# Altium schematic sheet 01-MCU.SchDoc
size A3
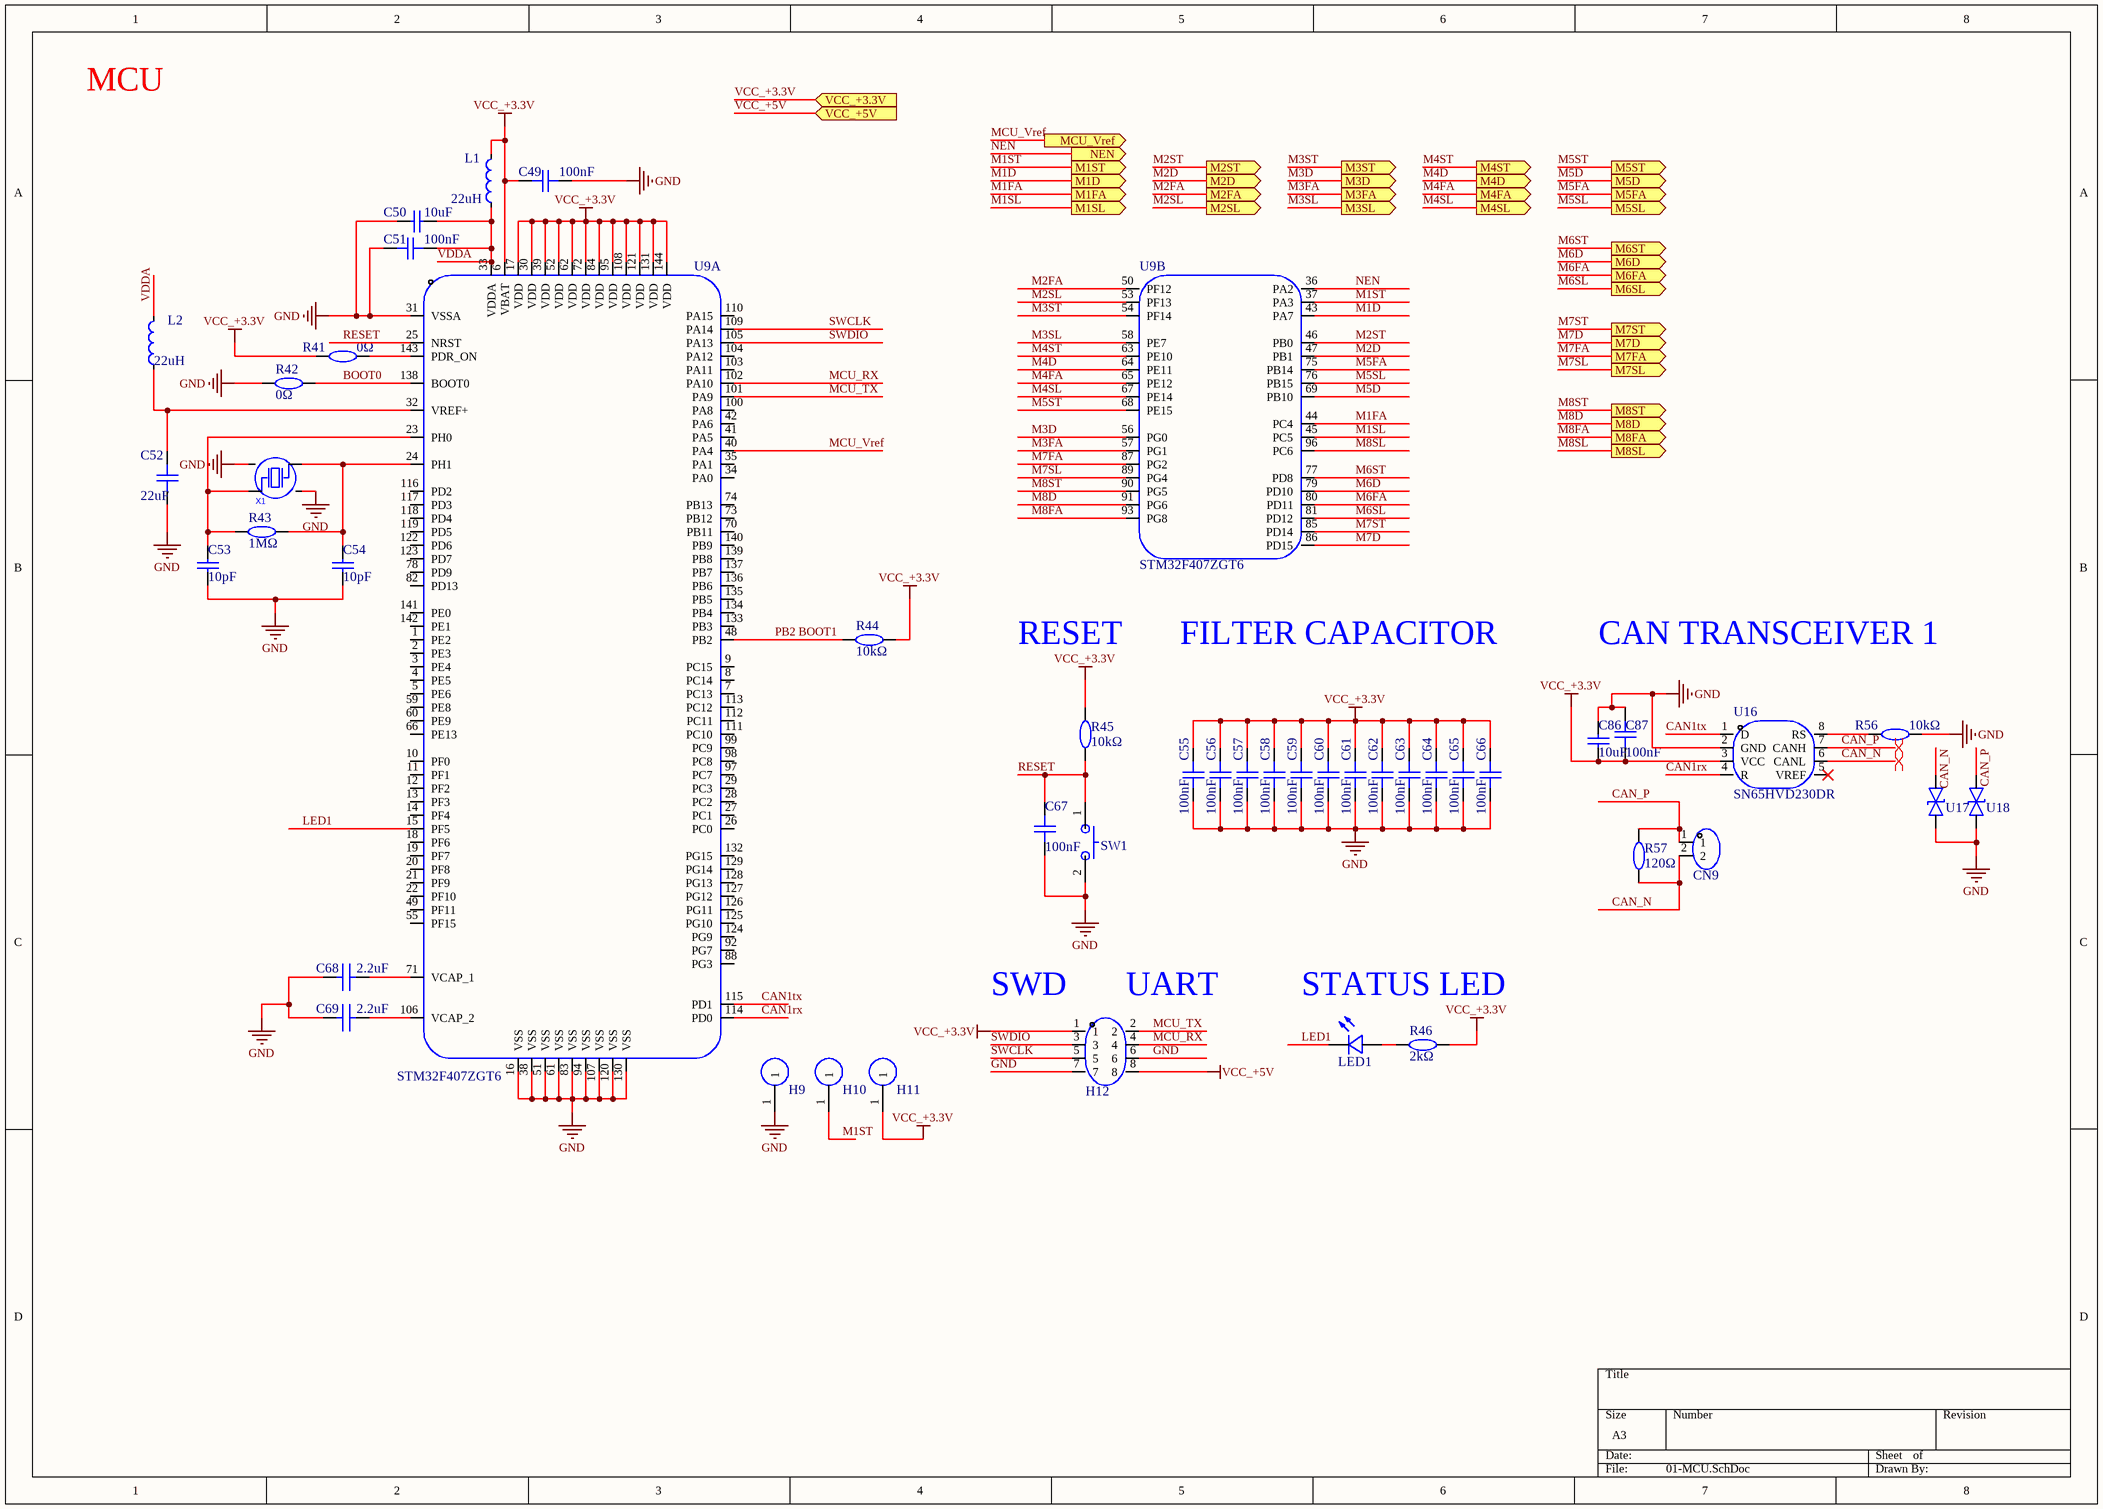
[diagram p0: 01-MCU.SchDoc]

## Parts
C49  100nF  [C0402_2.2uF]
C50  10uF  [C0402_2.2uF]
C51  100nF  [C0402_2.2uF]
C52  22uF  [C0603]
C53  10pF  [C0402_2.2uF]
C54  10pF  [C0402_2.2uF]
C55  100nF  [C0402_2.2uF]
C56  100nF  [C0402_2.2uF]
C57  100nF  [C0402_2.2uF]
C58  100nF  [C0402_2.2uF]
C59  100nF  [C0402_2.2uF]
C60  100nF  [C0402_2.2uF]
C61  100nF  [C0402_2.2uF]
C62  100nF  [C0402_2.2uF]
C63  100nF  [C0402_2.2uF]
C64  100nF  [C0402_2.2uF]
C65  100nF  [C0402_2.2uF]
C66  100nF  [C0402_2.2uF]
C67  100nF  [C0603]
C68  2.2uF  [C0402_2.2uF]
C69  2.2uF  [C0402_2.2uF]
C86  10uF  [C0402_2.2uF]
C87  100nF  [C0402_2.2uF]
CN9  ZX-XH2.54-2PZZ  [ZX-XH2.54-2PZZ]  (value not drawn)
H9  PZ254V-11-01P  [Testpoint]  (value not drawn)
H10  PZ254V-11-01P  [Testpoint]  (value not drawn)
H11  PZ254V-11-01P  [Testpoint]  (value not drawn)
H12  PZ254V-12-8P  [HC-1.25-8PLT]  (value not drawn)
L1  22uH  [L0603_22uH]
L2  22uH  [L0603_22uH]
LED1  MHT192UGCT  [LED]  (value not drawn)
R41  0Ω  [R0603]
R42  0Ω  [R0603]
R43  1MΩ  [R0603]
R44  10kΩ  [R0603_10KΩ]
R45  10kΩ  [R0603_10KΩ]
R46  2kΩ  [R0603]
R56  10kΩ  [R0603]
R57  120Ω  [R0603]
SW1  GT-TC029B-H020-L1N  [Switch]  (value not drawn)
U9  STM32F407ZGT6  [STM32F407ZGT6]  (parts A,B of 2)
U16  SN65HVD230DR  [SN65HVD230DR]
U17  PESD0603-240  [PESD0603-240]  (value not drawn)
U18  PESD0603-240  [PESD0603-240]  (value not drawn)
X1  8MHz  [Osc_8M]  (value not drawn)

## Ports
M1D (out), M1FA (out), M1SL (out), M1ST (out), M2D (out), M2FA (out), M2SL (out), M2ST (out), M3D (out), M3FA (out), M3SL (out), M3ST (out), M4D (out), M4FA (out), M4SL (out), M4ST (out), M5D (out), M5FA (out), M5SL (out), M5ST (out), M6D (out), M6FA (out), M6SL (out), M6ST (out), M7D (out), M7FA (out), M7SL (out), M7ST (out), M8D (out), M8FA (out), M8SL (out), M8ST (out), MCU_Vref (out), NEN (out), VCC_+3.3V (in), VCC_+5V (in)

## Nets
GND: C49.2 C50.1 C51.1 C52.1 C53.1 C54.1 C55.2 C56.2 C57.2 C58.2 C59.2 C60.2 C61.2 C62.2 C63.2 C64.2 C65.2 C66.2 C67.1 C68.1 C69.1 C86.2 C87.2 H9.1 H12.6 H12.7 R42.1 R56.2 SW1.2 U9.16(VSS) U9.31(VSSA) U9.38(VSS) U9.51(VSS) U9.61(VSS) U9.83(VSS) U9.94(VSS) U9.107(VSS) U9.120(VSS) U9.130(VSS) U16.2(GND) U17.1 U18.1 X1.2 X1.4
VCC_+3.3V: C49.1 C55.1 C56.1 C57.1 C58.1 C59.1 C60.1 C61.1 C62.1 C63.1 C64.1 C65.1 C66.1 C86.1 C87.1 H11.1 H12.1 L1.2 R41.1 R44.2 R45.2 R46.2 U9.6(VBAT) U9.17(VDD) U9.30(VDD) U9.39(VDD) U9.52(VDD) U9.62(VDD) U9.72(VDD) U9.84(VDD) U9.95(VDD) U9.108(VDD) U9.121(VDD) U9.131(VDD) U9.144(VDD) U16.3(VCC) ; port VCC_+3.3V
VCC_+5V: H12.8 ; port VCC_+5V
BOOT0: R42.2 U9.138(BOOT0)
CAN1rx: U9.114(PD0) U16.4(R)
CAN1tx: U9.115(PD1) U16.1(D)
CAN_N: CN9.2 R57.1 U16.6(CANL) U17.2
CAN_P: CN9.1 R57.2 U16.7(CANH) U18.2
LED1: LED1.1(-) U9.15(PF5)
M1D: U9.43(PA7) ; port M1D
M1FA: U9.44(PC4) ; port M1FA
M1SL: U9.45(PC5) ; port M1SL
M1ST: H10.1 U9.37(PA3) ; port M1ST
M2D: U9.47(PB1) ; port M2D
M2FA: U9.50(PF12) ; port M2FA
M2SL: U9.53(PF13) ; port M2SL
M2ST: U9.46(PB0) ; port M2ST
M3D: U9.56(PG0) ; port M3D
M3FA: U9.57(PG1) ; port M3FA
M3SL: U9.58(PE7) ; port M3SL
M3ST: U9.54(PF14) ; port M3ST
M4D: U9.64(PE11) ; port M4D
M4FA: U9.65(PE12) ; port M4FA
M4SL: U9.67(PE14) ; port M4SL
M4ST: U9.63(PE10) ; port M4ST
M5D: U9.69(PB10) ; port M5D
M5FA: U9.75(PB14) ; port M5FA
M5SL: U9.76(PB15) ; port M5SL
M5ST: U9.68(PE15) ; port M5ST
M6D: U9.79(PD10) ; port M6D
M6FA: U9.80(PD11) ; port M6FA
M6SL: U9.81(PD12) ; port M6SL
M6ST: U9.77(PD8) ; port M6ST
M7D: U9.86(PD15) ; port M7D
M7FA: U9.87(PG2) ; port M7FA
M7SL: U9.89(PG4) ; port M7SL
M7ST: U9.85(PD14) ; port M7ST
M8D: U9.91(PG6) ; port M8D
M8FA: U9.93(PG8) ; port M8FA
M8SL: U9.96(PC6) ; port M8SL
M8ST: U9.90(PG5) ; port M8ST
MCU_RX: H12.4 U9.102(PA10)
MCU_TX: H12.2 U9.101(PA9)
MCU_Vref: U9.40(PA4) ; port MCU_Vref
NEN: U9.36(PA2) ; port NEN
PB2 BOOT1: R44.1 U9.48(PB2)
RESET: C67.2 R45.1 SW1.1 U9.25(NRST)
SWCLK: H12.5 U9.109(PA14)
SWDIO: H12.3 U9.105(PA13)
VDDA: C50.2 C51.2 L1.1 L2.2 U9.33(VDDA)
NetC52_2: C52.2 L2.1 U9.32(VREF+)
NetC53_2: C53.2 R43.1 U9.23(PH0) X1.1
NetC54_2: C54.2 R43.2 U9.24(PH1) X1.3
NetC68_2: C68.2 U9.71(VCAP_1)
NetC69_2: C69.2 U9.106(VCAP_2)
NetLED1_2: LED1.2(+) R46.1
NetR41_2: R41.2 U9.143(PDR_ON)
NetR56_1: R56.1 U16.8(RS)

Not connected (* = marked no-connect by the designer): U9 1(PE2) 2(PE3) 3(PE4) 4(PE5) 5(PE6) 7(PC13) 8(PC14) 9(PC15) 10(PF0) 11(PF1) 12(PF2) 13(PF3) 14(PF4) 18(PF6) 19(PF7) 20(PF8) 21(PF9) 22(PF10) 26(PC0) 27(PC1) 28(PC2) 29(PC3) 34(PA0) 35(PA1) 41(PA5) 42(PA6) 49(PF11) 55(PF15) 59(PE8) 60(PE9) 66(PE13) 70(PB11) 73(PB12) 74(PB13) 78(PD9) 82(PD13) 88(PG3) 92(PG7) 97(PC7) 98(PC8) 99(PC9) 100(PA8) 103(PA11) 104(PA12) 110(PA15) 111(PC10) 112(PC11) 113(PC12) 116(PD2) 117(PD3) 118(PD4) 119(PD5) 122(PD6) 123(PD7) 124(PG9) 125(PG10) 126(PG11) 127(PG12) 128(PG13) 129(PG14) 132(PG15) 133(PB3) 134(PB4) 135(PB5) 136(PB6) 137(PB7) 139(PB8) 140(PB9) 141(PE0) 142(PE1); U16 5(VREF)*

## Layout directives
differential pair: CAN_N, CAN_P

## Notes on the sheet
- MCU
- RESET
- FILTER CAPACITOR
- CAN TRANSCEIVER 1
- (near H12) SWD
- (near H12) UART
- STATUS LED

## Library data of the parts
C49 C51 C55-C66 C87 = C0402_100nF: 0402电容; Manufacturer: muRata(村田); Symbol: GRM155R71H104KE14D; Add into BOM: yes; Tolerance: ±10%; Voltage Rated: 50V; Temperature Coefficient: X7R; Device: GRM155R71H104KE14D; LCSC Part Name: 100nF ±10% 50V; Supplier Part: C77020; Manufacturer Part: GRM155R71H104KE14D; Supplier Footprint: 0402; JLCPCB Part Class: Extended Part; Datasheet: https://atta.szlcsc.com/upload/public/pdf/source/20180326/C77020_39BD49C951FF1AF0DB1F1FAC5AC1E401.pdf; Supplier: LCSC; Convert to PCB: yes; Value: 100nF; Comment_1: 100nF
C50 C86 = C0402_10uF: 0402电容; Manufacturer: SAMSUNG(三星); Symbol: CL05A106MQ5NUNC; Add into BOM: yes; Tolerance: ±20%; Voltage Rated: 6.3V; Temperature Coefficient: X5R; Device: CL05A106MQ5NUNC; LCSC Part Name: 10uF ±20% 6.3V; Supplier Part: C15525; Manufacturer Part: CL05A106MQ5NUNC; Supplier Footprint: 0402; JLCPCB Part Class: Basic Part; Datasheet: https://atta.szlcsc.com/upload/public/pdf/source/20220823/2B02EE04F8F211D38A52DCB16EB6BEBA.pdf; Supplier: LCSC; Convert to PCB: yes; Value: 10uF; Comment_1: 10uF
C52 = C0603_22uF: 0603电容; Manufacturer: SAMSUNG(三星); Symbol: CC0603KRX7R9BB104; Add into BOM: yes; Tolerance: ±20%; Voltage Rated: 16V; Temperature Coefficient: X5R; Name: 22uF; Device: CC0603KRX7R9BB104; LCSC Part Name: 22uF ±20% 16V; Supplier Part: C6119868; Manufacturer Part: CC0603KRX7R9BB104; Supplier Footprint: 0603; JLCPCB Part Class: Basic Part; Datasheet: https://atta.szlcsc.com/upload/public/pdf/source/20180910/C282072_33301C7F631E79921B82A8DAC6BCC5B3.pdf; Supplier: LCSC; Convert to PCB: yes; Value: 22uF
C53 C54 = C0402_10pF: 0402电容; Manufacturer: FH(风华); Symbol: 0402CG100J500NT; Add into BOM: yes; Tolerance: ±5%; Voltage Rated: 50V; Temperature Coefficient: C0G; Device: 0402CG100J500NT; LCSC Part Name: 10pF ±5% 50V; Supplier Part: C1545; Manufacturer Part: 0402CG100J500NT; Supplier Footprint: 0402; JLCPCB Part Class: Extended Part; Datasheet: https://atta.szlcsc.com/upload/public/pdf/source/20200305/C486355_26A10D38EF8C2A5C37091D0039909270.pdf; Supplier: LCSC; Convert to PCB: yes; Value: 10pF; Comment_1: 10pF
C67 = C0603_100nF: 0603电容; Manufacturer: SAMSUNG(三星); Symbol: CC0603KRX7R9BB104; Add into BOM: yes; Tolerance: ±10%; Voltage Rated: 50V; Temperature Coefficient: X7R; Name: 100nF; Device: CC0603KRX7R9BB104; LCSC Part Name: 100nF ±10% 50V; Supplier Part: C6119867; Manufacturer Part: CC0603KRX7R9BB104; Supplier Footprint: 0603; JLCPCB Part Class: Basic Part; Datasheet: https://atta.szlcsc.com/upload/public/pdf/source/20180910/C282072_33301C7F631E79921B82A8DAC6BCC5B3.pdf; Supplier: LCSC; Convert to PCB: yes; Value: 100nF
C68 C69 = C0402_2.2uF: 容值 2.2uF   精度 ±20%   额定电压 6.3V   材质(温度系数) X5R; Manufacturer: SAMSUNG(三星); Symbol: CL05A225MQ5NSNC; Add into BOM: yes; Device: CL05A225MQ5NSNC; LCSC Part Name: 2.2uF ±20% 6.3V; Supplier Part: C12530; Manufacturer Part: CL05A225MQ5NSNC; Supplier Footprint: 0402; JLCPCB Part Class: Basic Part; Datasheet: https://atta.szlcsc.com/upload/public/pdf/source/20160218/1457707763339.pdf; Supplier: LCSC; Convert to PCB: yes; Value: 2.2uF; Tolerance: ±20%; Voltage Rated: 6.3V; Temperature Coefficient: X5R; Comment_1: 2.2uF
CN9 = ZX-XH2.54-2PZZ: 直插插针; Manufacturer: Megastar(兆星); Add into BOM: yes; Pins Structure: 1x2P; Pitch: 2.54mm; Reference Series: XH; Number of PINs Per Row: 2; Current Rating (Max): 3A; Symbol: ZX-XH2.54-2PZZ; Device: ZX-XH2.54-2PZZ; LCSC Part Name: ZX-XH2.54-2PZZ; Supplier Part: C7429632; Manufacturer Part: ZX-XH2.54-2PZZ; Supplier Footprint: 插件,P=2.54mm; JLCPCB Part Class: Extended Part; Datasheet: https://atta.szlcsc.com/upload/public/pdf/source/20230619/19BA6947230AA44A04D3EDD65E618FD0.pdf; Supplier: LCSC; Convert to PCB: yes; Mounting Style: 直插; Number of Pins: 2P; Number of Rows: 1; Row Spacing: -; Contact Material: 黄铜; Contact Plating: 锡; Operating Temperature Range: -25℃~+85℃; Comment_1: ZX-XH2.54-2PZZ
H9-H11 = Testpoint: 测试点; Manufacturer: XFCN(兴飞); Add into BOM: yes; Pin Structure: 1x1P; Pitch: 2.54mm; Circluar Pins/Square Pins: 方针; Symbol: PZ254V-11-01P; Device: PZ254V-11-01P; LCSC Part Name: 间距:2.54mm 1x1P 直插 方针; Supplier Part: C492400; Manufacturer Part: PZ254V-11-01P; Supplier Footprint: 插件,P=2.54mm; JLCPCB Part Class: Extended Part; Datasheet: https://atta.szlcsc.com/upload/public/pdf/source/20200309/C492400_46876A5B545F5AE6B8D4A09C46E276E8.pdf; Supplier: LCSC; Convert to PCB: yes; Row Spacing: -; Mounting Type: 直插; Number of Rows: 单排; Number of Pins: 1P; Current Rating (Max): -; Voltage Rating (Max): -; Length of Mating Pin: 6mm; Insulation Height: 2.5mm; Length of End Connection Pin: 3mm; Contact Material: 黄铜; Contact Plating: -; Operating Temperature Range: -40℃~+105℃; Color: 黑色; Comment_1: PZ254V-11-01P
H12 = HC-1.25-8PLT: 排针8P; Manufacturer: XFCN(兴飞); Add into BOM: yes; Pin Structure: 2x4P; Pitch: 2.54mm; Circluar Pins/Square Pins: 方针; Symbol: PZ254V-12-8P; Device: PZ254V-12-8P; LCSC Part Name: 间距:2.54mm 2x4P 直插 方针; Supplier Part: C492421; Manufacturer Part: PZ254V-12-8P; Supplier Footprint: 插件,P=2.54mm; JLCPCB Part Class: Extended Part; Datasheet: https://atta.szlcsc.com/upload/public/pdf/source/20200309/C492421_DC8A206AF99CD7755BD4A5B0BC48200B.pdf; Supplier: LCSC; Convert to PCB: yes; Row Spacing: 2.54mm; Mounting Type: 直插; Number of Rows: 双排; Number of Pins: 8P; Current Rating (Max): -; Voltage Rating (Max): -; Length of Mating Pin: 6mm; Insulation Height: 2.5mm; Length of End Connection Pin: 3mm; Contact Material: 黄铜; Contact Plating: -; Operating Temperature Range: -40℃~+105℃; Color: 黑色; Comment_1: PZ254V-12-8P
L1 L2 = L0603_22uH: 0603电感; Manufacturer: TDK; Symbol: MLZ1608M220WT000; Add into BOM: yes; Tolerance: ±20%; Saturation Current (Isat): 55mA; DC Resistance (DCR): 2.4Ω; Device: MLZ1608M220WT000; LCSC Part Name: 22uH ±20% 55mA; Supplier Part: C383393; Manufacturer Part: MLZ1608M220WT000; Supplier Footprint: 0603; JLCPCB Part Class: Extended Part; Datasheet: https://atta.szlcsc.com/upload/public/pdf/source/20160918/1474166926388.pdf; Supplier: LCSC; Convert to PCB: yes; Value: 22uH; Rated Current: -; Q @ Freq: -; Frequency - Self Resonant: -; Ratings: -; Comment_1: 22uH
LED1 = LED: 发光二极管 绿色; Manufacturer: MEIHUA(美华); Add into BOM: yes; Emitted Color: 翠绿色; Power Dissipation: 60mW; Forward Current: 20mA; Dominant Wavelength: 515nm~530nm; Peak Wavelength: 518nm; Lens Color: 无色透明透镜; Viewing Angle: 120°; Symbol: MHT192UGCT; Device: MHT192UGCT; LCSC Part Name: 翠绿; Supplier Part: C389519; Manufacturer Part: MHT192UGCT; Supplier Footprint: 0603; JLCPCB Part Class: Extended Part; Datasheet: https://atta.szlcsc.com/upload/public/pdf/source/20190515/C389519_7BC27E831414348C8AF19AF18EE4BF58.pdf; Supplier: LCSC; Convert to PCB: yes; Diode Configuration: -; Color Temperature: -; Mounting Sytle: -; Operating Temperature: -40℃~+85℃; Comment_1: MHT192UGCT
R41 R42 = R0603_0Ω: 阻值 0Ω   精度 ±1%   功率 100mW   最大工作电压 75V   工作温度范围 -55℃~+155℃; Manufacturer: UNI-ROYAL(厚声); Symbol: 0603WAF0000T5E; Add into BOM: yes; Device: 0603WAF0000T5E; LCSC Part Name: 0Ω ±1% 100mW 厚膜电阻; Supplier Part: C21189; Manufacturer Part: 0603WAF0000T5E; Supplier Footprint: 0603; JLCPCB Part Class: Basic Part; Datasheet: https://atta.szlcsc.com/upload/public/pdf/source/20200306/C422600_1E6D84923E4A46A82E41ADD87F860B5C.pdf; Supplier: LCSC; Convert to PCB: yes; Type: 厚膜电阻; Value: 0Ω; Tolerance: ±1%; Power(Watts): 100mW; Overload Voltage (Max): 75V; Operating Temperature Range: -55℃~+155℃; Comment_1: 0Ω
R43 = R0603_1MΩ: 0603电阻; Manufacturer: UNI-ROYAL(厚声); Symbol: 0603WAF5100T5E; Add into BOM: yes; Tolerance: ±1%; Power(Watts): 100mW; Overload Voltage (Max): 75V; Temperature Coefficient: ±100ppm/℃; Name: 1MΩ; Device: 0603WAF5100T5E; LCSC Part Name: 1MΩ ±1% 100mW 厚膜电阻; Supplier Part: C22935; Manufacturer Part: 0603WAF5100T5E; Supplier Footprint: 0603; JLCPCB Part Class: Basic Part; Datasheet: https://atta.szlcsc.com/upload/public/pdf/source/20200306/C422600_1E6D84923E4A46A82E41ADD87F860B5C.pdf; Supplier: LCSC; Convert to PCB: yes; Type: 厚膜电阻; Value: 1MΩ; Operating Temperature Range: -55℃~+155℃
R44 R45 R56 = R0603_10KΩ: 0603电阻; Manufacturer: UNI-ROYAL(厚声); Symbol: 0603WAF1002T5E; Add into BOM: yes; Tolerance: ±1%; Power(Watts): 100mW; Overload Voltage (Max): 75V; Temperature Coefficient: ±100ppm/℃; Device: 0603WAF1002T5E; LCSC Part Name: 厚膜电阻 10kΩ ±1% 100mW; Supplier Part: C25804; Manufacturer Part: 0603WAF1002T5E; Supplier Footprint: 0603; JLCPCB Part Class: Basic Part; Datasheet: https://atta.szlcsc.com/upload/public/pdf/source/20200306/C422600_1E6D84923E4A46A82E41ADD87F860B5C.pdf; Supplier: LCSC; Convert to PCB: yes; Type: 厚膜电阻; Value: 10kΩ; Operating Temperature Range: -55℃~+155℃; Comment_1: 10kΩ
R46 = R0603_2KΩ: 0603电阻; Manufacturer: UNI-ROYAL(厚声); Symbol: 0603WAF2001T5E; Add into BOM: yes; Tolerance: ±1%; Power(Watts): 100mW; Overload Voltage (Max): 75V; Temperature Coefficient: ±100ppm/℃; Device: 0603WAF2001T5E; LCSC Part Name: 2kΩ ±1% 100mW 厚膜电阻; Supplier Part: C22975; Manufacturer Part: 0603WAF2001T5E; Supplier Footprint: 0603; JLCPCB Part Class: Basic Part; Datasheet: https://atta.szlcsc.com/upload/public/pdf/source/20200306/C422600_1E6D84923E4A46A82E41ADD87F860B5C.pdf; Supplier: LCSC; Convert to PCB: yes; Type: 厚膜电阻; Value: 2kΩ; Operating Temperature Range: -55℃~+155℃; Comment_1: 2kΩ
R57 = R0603_120Ω: 0603电阻; Manufacturer: UNI-ROYAL(厚声); Symbol: 0603WAF1200T5E; Add into BOM: yes; Tolerance: ±1%; Power(Watts): 100mW; Overload Voltage (Max): 75V; Temperature Coefficient: ±100ppm/℃; Device: 0603WAF1200T5E; LCSC Part Name: 120Ω ±1% 100mW 厚膜电阻; Supplier Part: C22787; Manufacturer Part: 0603WAF1200T5E; Supplier Footprint: 0603; JLCPCB Part Class: Basic Part; Datasheet: https://atta.szlcsc.com/upload/public/pdf/source/20200306/C422600_1E6D84923E4A46A82E41ADD87F860B5C.pdf; Supplier: LCSC; Convert to PCB: yes; Type: 厚膜电阻; Value: 120Ω; Operating Temperature Range: -55℃~+155℃; Comment_1: 120Ω
SW1 = Switch: 轻触开关   电路结构 单刀单掷   按钮形状 圆形按钮   作用力 2.5N   安装方式 立贴   开关长度 3.9mm   开关宽度 2.9mm   开关高度 2mm   带支架 不带   触点电流 50mA   额定电压(DC) 12V; Manufacturer: G-Switch(品赞); Add into BOM: yes; Insulation Resistance: 100MΩ; Actuator/Cap Color: 黑色; With Lamp: 无; Pin Style: SMD接片; Mechanical Life: 10万次; Symbol: GT-TC029B-H020-L1N; Device: GT-TC029B-H020-L1N; LCSC Part Name: 3.9*2.9*2mm 立贴 轻触开关; Supplier Part: C843665; Manufacturer Part: GT-TC029B-H020-L1N; Supplier Footprint: SMD; JLCPCB Part Class: Extended Part; Datasheet: https://atta.szlcsc.com/upload/public/pdf/source/20231124/F8327E72251744D4A6AAF7192EF342CB.pdf; Supplier: LCSC; Convert to PCB: yes; Circuit: 单刀单掷; Actuator Style: 圆形按钮; Operating Force: 2.5N; Mounting Style: 立贴; Switch Length: 3.9mm; Switch Width: 2.9mm; Switch Height: 2mm; Strike Gundam: 不带; Contact Current: 50mA; Voltage Rating (DC): 12V; Operating Temperature: -30℃~+85℃; Comment_1: GT-TC029B-H020-L1N
U9 = STM32F407ZGT6: CPU内核：ARM-M4  程序存储容量：1MB  RAM总容量：192KB  GPIO端口数量：114  工作电压范围：1.8V~3.6V  CPU最大主频：168MHz  程序存储器类型：FLASH  工作温度范围：-40℃~+85℃  ADC(位数)：12bit  DAC(位数)：12bit; Manufacturer: ST(意法半导体); Add into BOM: yes; CPU Core: ARM-M4; Program Storage Size: 1MB; RAM Size: 192KB; GPIO Ports Number: 114; CPU Maximum Speed: 168MHz; Program Memory Type: FLASH; ADC (Bit): 12bit; Universal Serial Bus: 有; Peripheral/Function: DMA；LCD/LED驱动; Symbol: STM32F407ZGT6; Device: STM32F407ZGT6; LCSC Part Name: 带DSP和FPU的高性能基础系列ARM Cortex-M4 MCU，具有1 MB Flash、168 MHz CPU、ART加速器、以太网和FSMC; Supplier Part: C19156; Manufacturer Part: STM32F407ZGT6; Supplier Footprint: LQFP-144(20x20); JLCPCB Part Class: Extended Part; Datasheet: https://atta.szlcsc.com/upload/public/pdf/source/20140801/1457707197138.pdf; Supplier: LCSC; Convert to PCB: yes; Operating Voltage Range: 1.8V~3.6V; Operating Temperature Range: -40℃~+85℃; DAC (Bit): 12bit; PWM (Bit): -; Internal Comparator: -; communication protocol: -; Watchdog: 有; Real-Time Clock: -; Infrared Data Association: 有; Low-Voltage Detect: 有; CCP Capture/Compare: -; LCD Module: 有; Secure Digital Input and Output: -; Direct Memory Access: 有; Internal Oscillator: 有; Comment_1: STM32F407ZGT6
U16 = SN65HVD230DR: CAN收发器; Manufacturer: TI(德州仪器); Add into BOM: yes; Data Rate: 1Mbps; Supply Voltage: 3V~3.6V; Symbol: SN65HVD230DR; Device: SN65HVD230DR; LCSC Part Name: 1Mbps 3V~3.6V; Supplier Part: C12084; Manufacturer Part: SN65HVD230DR; Supplier Footprint: SOIC-8; JLCPCB Part Class: Extended Part; Datasheet: https://www.ti.com/cn/lit/gpn/sn65hvd230; Supplier: LCSC; Convert to PCB: yes; Type: 收发器; Operating Temperature: -40℃~+85℃; Comment_1: SN65HVD230DR
U17 U18 = PESD0603-240: ESD; Manufacturer: Littelfuse(美国力特); Symbol: PESD0603-240_C2929617; Add into BOM: yes; Maximum Clamping Voltage: 45V; Number of Lines: 单路; Device: PESD0603-240_C2929617; LCSC Part Name: PESD0603-240; Supplier Part: C2929617; Manufacturer Part: PESD0603-240; Supplier Footprint: 0603; JLCPCB Part Class: Extended Part; Datasheet: https://atta.szlcsc.com/upload/public/pdf/source/20180516/C207186_7CE2F9DCABF8CE4AA3105E54FFDB24F6.pdf; Supplier: LCSC; Convert to PCB: yes; Breakdown Voltage: -; Type: ESD; Comment_1: PESD0603-240
X1 = Osc_8M: 8Mhz晶振; Manufacturer: YJX(雅晶鑫); Symbol: TAXM8M4RDBCCT2T; Add into BOM: yes; Crystal Type: 贴片晶振; Normal temperature Frequency Tolerance: ±10ppm; External load capacitor: 10pF; Frequency Stability(Full temperature range): ±15ppm; Equivalent Series Resistance (ESR): 250Ω; Device: TAXM8M4RDBCCT2T; LCSC Part Name: 8MHz ±10ppm 10pF; Supplier Part: C400090; Manufacturer Part: TAXM8M4RDBCCT2T; Supplier Footprint: SMD3225-4P; JLCPCB Part Class: Extended Part; Datasheet: https://atta.szlcsc.com/upload/public/pdf/source/20190626/C400090_CF95B89E745AFE4EF2E392EF8AC009D6.pdf; Supplier: LCSC; Convert to PCB: yes; Value: 8MHz; Operating Temperature: -40℃~+85℃; Comment_1: 8MHz